# Altium schematic sheet A2_BLUEsat_Altium.SchDoc: Title Block Template
size A2; Engineer: M. BRINDLEY; Organization: BLUEsat Project; Address1: Room 419; Address2: School of EE&T; Address3: UNSW, NSW 2052; Address4: Australia; DocumentNumber: TITL0001; Description: Sample Title Block; Version: 1.0
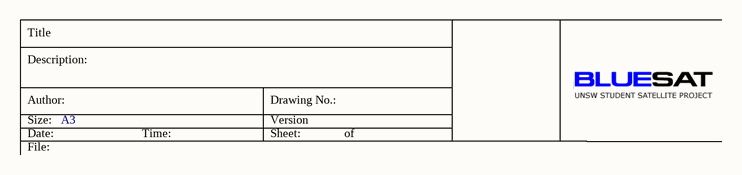
[diagram p0: A2_BLUEsat_Altium.SchDoc]

## Notes on the sheet
- Title
- Description:
- Size:
- Author:
- Date:
- File:
- A3
- Time:
- Version
- Sheet:
- Drawing No.:
- of